# EAGLE design Board V.1B (EAGLE 5.06)
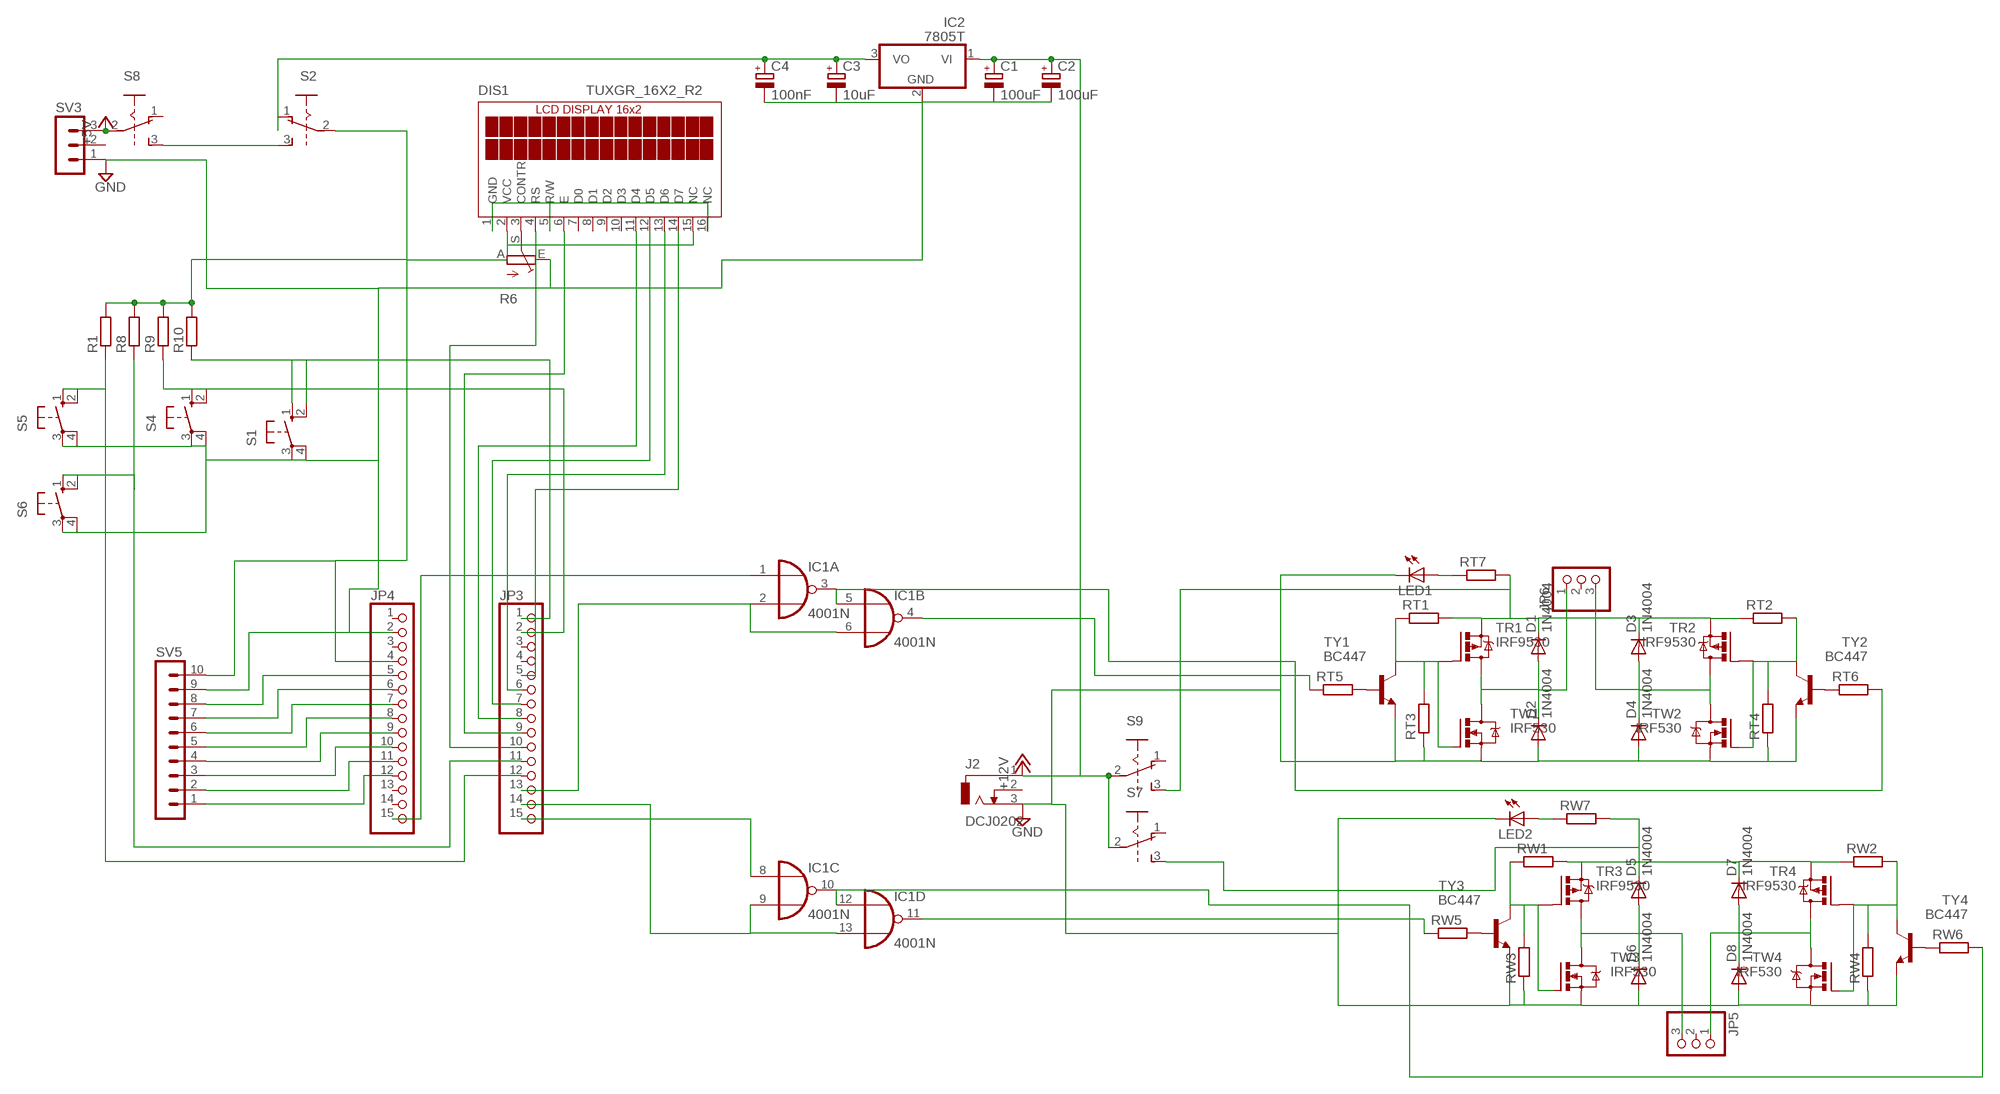
[diagram p0: schematic, sheet 1]

## Parts
C1  100uF  CPOL-EUE2.5-6  [E2,5-6]
C2  100uF  CPOL-EUE2.5-6  [E2,5-6]
C3  10uF  CPOL-EUE2.5-6  [E2,5-6]
C4  100nF  CPOL-EUE2.5-6  [E2,5-6]
D1  1N4004  [DO41-10]
D2  1N4004  [DO41-10]
D3  1N4004  [DO41-10]
D4  1N4004  [DO41-10]
D5  1N4004  [DO41-10]
D6  1N4004  [DO41-10]
D7  1N4004  [DO41-10]
D8  1N4004  [DO41-10]
DIS1  TUXGR_16X2_R2  [TUXGR_16X2_R2]
IC1  4001N  [DIL14]
IC2  7805T  [TO220H]
J2  DCJ0202  [DCJ0202]
JP3  PINHD-1X15  [1X15]
JP4  PINHD-1X15  [1X15]
JP5  PINHD-1X3  [1X03]
JP6  PINHD-1X3  [1X03]
LED1  LED5MM  [LED5MM]
LED2  LED5MM  [LED5MM]
R1  R-EU_0204/7  [0204/7]
R6  TRIM_EU-B25P  [B25P]
R8  R-EU_0204/7  [0204/7]
R9  R-EU_0204/7  [0204/7]
R10  R-EU_0204/7  [0204/7]
RT1  R-EU_0207/7  [0207/7]
RT2  R-EU_0207/7  [0207/7]
RT3  R-EU_0207/7  [0207/7]
RT4  R-EU_0207/7  [0207/7]
RT5  R-EU_0207/7  [0207/7]
RT6  R-EU_0207/7  [0207/7]
RT7  R-EU_0207/7  [0207/7]
RW1  R-EU_0207/7  [0207/7]
RW2  R-EU_0207/7  [0207/7]
RW3  R-EU_0207/7  [0207/7]
RW4  R-EU_0207/7  [0207/7]
RW5  R-EU_0207/7  [0207/7]
RW6  R-EU_0207/7  [0207/7]
RW7  R-EU_0207/7  [0207/7]
S1  10-XX  [B3F-10XX]
S2  A68-A31  [A68-A31]
S4  10-XX  [B3F-10XX]
S5  10-XX  [B3F-10XX]
S6  10-XX  [B3F-10XX]
S7  A68-A31  [A68-A31]
S8  A68-A31  [A68-A31]
S9  A68-A31  [A68-A31]
SV3  MA03-1  [MA03-1]
SV5  MA10-1  [MA10-1]
TR1  IRF9530  [TO220BV]
TR2  IRF9530  [TO220BV]
TR3  IRF9530  [TO220BV]
TR4  IRF9530  [TO220BV]
TW1  IRF530  [TO220BV]
TW2  IRF530  [TO220BV]
TW3  IRF530  [TO220BV]
TW4  IRF530  [TO220BV]
TY1  BC447  [TO92-EBC]
TY2  BC447  [TO92-EBC]
TY3  BC447  [TO92-EBC]
TY4  BC447  [TO92-EBC]

## Nets
12V-A: D1.C D3.C RT1.2 RT2.1 RT7.2 S9.3(A:S) TR1.S TR2.S
12V-B: D5.C D7.C RW1.2 RW2.1 RW7.2 S7.3(A:S) TR3.S TR4.S
+5V: S8.2(A:P) SV3.3
+5V2: DIS1.2(VCC) DIS1.15(NC) JP4.4 R1.2 R6.A R8.2 R9.2 R10.2 S2.2(A:P) SV5.10
+12V: C1.+ C2.+ IC2.1(VI) J2.1 S7.2(A:P) S9.2(A:P)
GND: C1.- C2.- C3.- C4.- D2.A D4.A D6.A D8.A IC2.2(GND) J2.3 JP4.2 LED1.K(C) LED2.K(C) R6.E RT3.1 RT4.1 RW3.1 RW4.1 S1.3(P) S1.4(P1) S4.3(P) S4.4(P1) S5.3(P) S5.4(P1) S6.3(P) S6.4(P1) SV3.1 SV5.9 TW1.S TW2.S TW3.S TW4.S TY1.E TY2.E TY3.E TY4.E
N$1: LED1.A RT7.1
N$2: LED2.A RW7.1
N$3: IC1.4(B:O) RT5.1
N$4: IC1.1(A:I0) JP4.15
N$5: S2.3(A:S) S8.3(A:S)
N$7: JP3.1 R10.1 S1.1(S) S1.2(S1)
N$8: C3.+ C4.+ IC2.3(VO)
N$9: RT1.1 RT3.2 TR1.G TW1.G TY1.C
N$11: DIS1.4(RS) JP3.10
N$12: IC1.8(C:I0) JP3.15
N$13: DIS1.3(CONTR) R6.S
N$14: DIS1.6(E) JP3.9
N$16: DIS1.11(D4) JP3.8
N$17: RT5.2 TY1.B
N$18: RT6.1 TY2.B
N$19: RT2.2 RT4.2 TR2.G TW2.G TY2.C
N$20: D7.A D8.C JP5.1 TR4.D TW4.D
N$21: D5.A D6.C JP5.3 TR3.D TW3.D
N$22: RW2.2 RW4.2 TR4.G TW4.G TY4.C
N$23: JP4.5 SV5.8
N$24: JP4.6 SV5.7
N$25: JP4.7 SV5.6
N$26: JP4.8 SV5.5
N$27: JP4.9 SV5.4
N$28: DIS1.12(D5) JP3.7
N$29: DIS1.13(D6) JP3.6
N$30: DIS1.14(D7) JP3.5
N$31: RW1.1 RW3.2 TR3.G TW3.G TY3.C
N$32: JP3.2 R9.1 S4.1(S) S4.2(S1)
N$33: JP3.11 R8.1 S6.1(S) S6.2(S1)
N$34: JP3.12 R1.1 S5.1(S) S5.2(S1)
N$35: RW6.1 TY4.B
N$36: DIS1.1(GND) DIS1.5(R/W) DIS1.16(NC)
N$38: RW5.2 TY3.B
N$40: IC1.2(A:I1) IC1.6(B:I1) JP3.13
N$45: IC1.9(C:I1) IC1.13(D:I1) JP3.14
N$46: JP4.10 SV5.3
N$47: JP4.11 SV5.2
N$49: JP4.12 SV5.1
N$51: D1.A D2.C JP6.1 TR1.D TW1.D
N$52: D3.A D4.C JP6.3 TR2.D TW2.D
N$53: IC1.3(A:O) IC1.5(B:I0) RT6.2
N$54: IC1.10(C:O) IC1.12(D:I0) RW6.2
N$55: IC1.11(D:O) RW5.1
Unconnected: DIS1.7(D0) DIS1.8(D1) DIS1.9(D2) DIS1.10(D3) J2.2 JP3.3 JP3.4 JP4.1 JP4.3 JP4.13 JP4.14 JP5.2 JP6.2 S2.1(A:O) S2.4(B:O) S2.5(B:P) S2.6(B:S) S7.1(A:O) S7.4(B:O) S7.5(B:P) S7.6(B:S) S8.1(A:O) S8.4(B:O) S8.5(B:P) S8.6(B:S) S9.1(A:O) S9.4(B:O) S9.5(B:P) S9.6(B:S) SV3.2

## Power pins joined to a net without a drawn wire
+5V: IC1.14(P:VDD)
GND: IC1.7(P:VSS)

## Library data of the parts
C1-C4 = resistor:CPOL-EU: POLARIZED CAPACITOR, European symbol
D1-D8 = diode:1N4004: DIODE general purpose rectifier, 1 A
DIS1 = display-lcd:TUXGR_16X2_R2: Tuxgraphics LCD display 16x2 characters reflective, without background light Source: tuxgr_12x2_r2.pdf
IC1 = 40xx:4001: Quad 2-input NOR
IC2 = linear:78*: Positive VOLTAGE REGULATOR Source: http://cache.national.com/ds/LM/LM78L05.pdf http://www.fairchildsemi.com/ds/LM/LM7805.pdf
J2 = con-jack:DCJ0202: DC POWER JACK Source: DCJ0202.pdf
JP3 JP4 = pinhead:PINHD-1X15: PIN HEADER
JP5 JP6 = pinhead:PINHD-1X3: PIN HEADER
LED1 LED2 = led:LED: LED OSRAM: - CHIPLED LG R971, LG N971, LY N971, LG Q971, LY Q971, LO R971, LY R971 LH N974, LH R974 LS Q976, LO Q976, LY Q976 LO Q996 - Hyper CHIPLED LW Q18S LB Q993, LB Q99A, LB R99A - SideLED LS A670, LO A670, LY A670, LG A670, LP A670 LB A673, LV A673, LT A673, LW A673 LH A674 LY A675 LS A676, LA A676, LO A676, LY A676, LW A676 LS A679, LY A679, LG A679 - Hyper Micro SIDELED® LS Y876, LA Y876, LO Y876, LY Y876 LT Y87S - SmartLED LW L88C, LW L88S LB L89C, LB L89S, LG L890 LS L89K, LO L89K, LY L89K LS L896, LA L896, LO L896, LY L896 - TOPLED LS T670, LO T670, LY T670, LG T670, LP T670 LSG T670, LSP T670, LSY T670, LOP T670, LYG T670 LG T671, LOG T671, LSG T671 LB T673, LV T673, LT T673, LW T673 LH T674 LS T676, LA T676, LO T676, LY T676, LB T676, LH T676, LSB T676, LW T676 LB T67C, LV T67C, LT T67C, LS T67K, LO T67K, LY T67K, LW E67C LS E67B, LA E67B, LO E67B, LY E67B, LB E67C, LV E67C, LT E67C LW T67C LS T679, LY T679, LG T679 LS T770, LO T770, LY T770, LG T770, LP T770 LB T773, LV T773, LT T773, LW T773 LH T774 LS E675, LA E675, LY E675, LS T675 LS T776, LA T776, LO T776, LY T776, LB T776 LHGB T686 LT T68C, LB T68C - Hyper Mini TOPLED® LB M676 - Mini TOPLED Santana® LG M470 LS M47K, LO M47K, LY M47K Source: http://www.osram.convergy.de LUXEON: - LUMILED® LXK2-PW12-R00, LXK2-PW12-S00, LXK2-PW14-U00, LXK2-PW14-V00 LXK2-PM12-R00, LXK2-PM12-S00, LXK2-PM14-U00 LXK2-PE12-Q00, LXK2-PE12-R00, LXK2-PE12-S00, LXK2-PE14-T00, LXK2-PE14-U00 LXK2-PB12-K00, LXK2-PB12-L00, LXK2-PB12-M00, LXK2-PB14-N00, LXK2-PB14-P00, LXK2-PB14-Q00 LXK2-PR12-L00, LXK2-PR12-M00, LXK2-PR14-Q00, LXK2-PR14-R00 LXK2-PD12-Q00, LXK2-PD12-R00, LXK2-PD12-S00 LXK2-PH12-R00, LXK2-PH12-S00 LXK2-PL12-P00, LXK2-PL12-Q00, LXK2-PL12-R00 Source: www.luxeon.com KINGBRIGHT: KA-3528ASYC Source: www.kingbright.com
R1 R8-R10 RT1-RT7 RW1-RW7 = resistor:R-EU_: RESISTOR, European symbol
R6 = pot:TRIM_EU-: POTENTIOMETER
S1 S4-S6 = switch-omron:10-XX: OMRON SWITCH
S2 S7-S9 = switch:A68-A31: SLIDING SWITCH Siemens, distributor Buerklin, 11G766
SV3 = con-lstb:MA03-1: PIN HEADER
SV5 = con-lstb:MA10-1: PIN HEADER
TR1-TR4 = transistor-power:IRF9530: P-CHANNEL HEXFET POWER-MOS-FET Source: http://www.irf.com/product-info/datasheets/data/irf9530.pdf
TW1-TW4 = transistor-power:IRF530: HEXFET Power MOSFET
TY1-TY4 = transistor-npn:BC447*: NPN Transistor

## Net classes
0 default: width 0.051 mm, clearance 0.051 mm

## Board
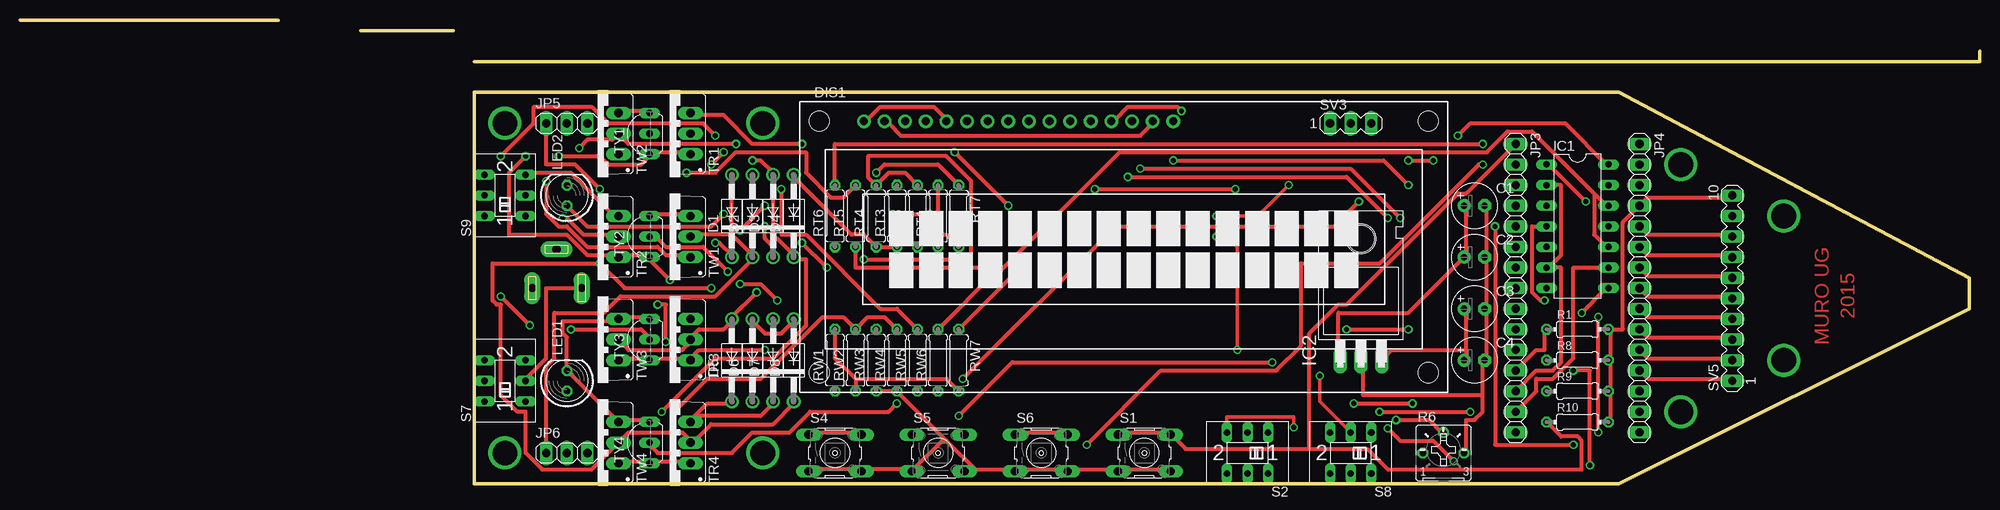
[diagram p1: board, top side]
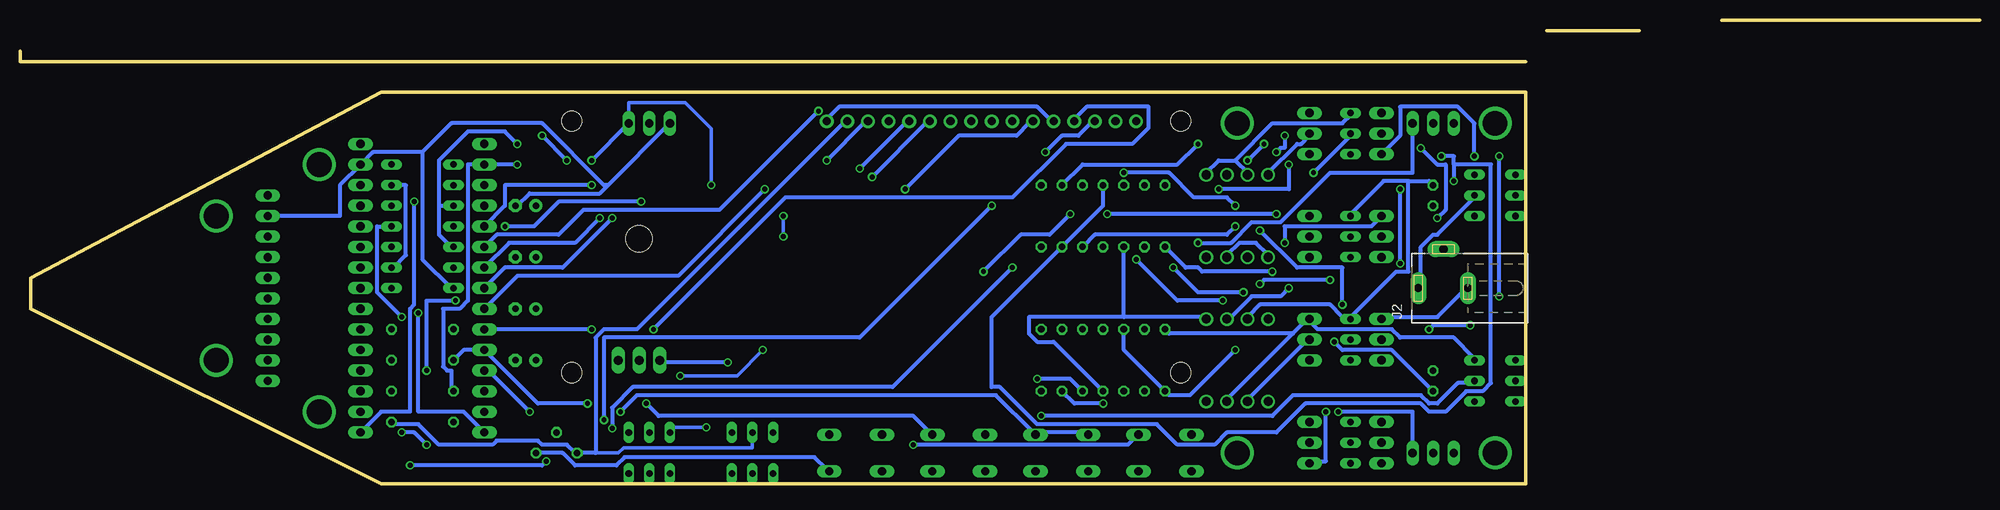
[diagram p2: board, bottom side, seen from below]

Size 241.3 x 57.15 mm. Coordinates in mm from the lower left corner, seen from the top.
Outline: 55.88,52.07 241.3,52.07 241.3,53.34
Outline: 31.75,57.15 0,57.15
Outline: 53.34,55.88 41.91,55.88
Outline: 196.85,48.26 55.88,48.26 55.88,0 196.85,0 240.03,21.59 240.03,25.4 196.85,48.26
Copper layers (1*16): Top 0.035mm / dielectric 1.5mm / Bottom 0.035mm
Design rules "default *": minimum track width 20mil, minimum drill 24mil, track to track 8mil, track to pad 8mil, pad to pad 8mil, via to via 8mil, smd to smd 8mil, copper to edge 40mil, drill to drill 8mil, minimum pad ring 10mil, minimum via ring 8mil, stop-mask expansion 4mil, vias tented up to drill 0mil, thermal gap 10mil

### Footprints (pad centres in the part's own frame; a part is rotated, then mirrored left to right if it is on the bottom)
E2,5-6 = drill 0.813 pad 1.6 round: + -1.27,0 | drill 0.813 pad 1.6 octagon: - 1.27,0
DO41-10 = drill 1.118 round: A 5.08,0; C -5.08,0
TUXGR_16X2_R2 = drill 1 pad 1.676 round: 1 -32,15.5; 2 -29.46,15.5; 3 -26.92,15.5; 4 -24.38,15.5; 5 -21.84,15.5; 6 -19.3,15.5; 7 -16.76,15.5; 8 -14.22,15.5; 9 -11.68,15.5; 10 -9.14,15.5; 11 -6.6,15.5; 12 -4.06,15.5; 13 -1.52,15.5; 14 1.02,15.5; 15 3.56,15.5; 16 6.1,15.5 | hole 2.5: -37.5,-15.5; 37.5,-15.5; -37.5,15.5; 37.5,15.5
DIL14 = drill 0.813 long: 1 -7.62,-3.81; 2 -5.08,-3.81; 3 -2.54,-3.81; 4 0,-3.81; 5 2.54,-3.81; 6 5.08,-3.81; 7 7.62,-3.81; 8 7.62,3.81; 9 5.08,3.81; 10 2.54,3.81; 11 0,3.81; 12 -2.54,3.81; 13 -5.08,3.81; 14 -7.62,3.81
TO220H = drill 1.118 long: 1 -2.54,-10.16; 2 0,-10.16; 3 2.54,-10.16 | hole 3.302: 0,4.826
DCJ0202 = drill 1 pad 2 long: 1 0,3.1; 2 4.8,0; 3 0,-3
1X15 = drill 1.016 long: 1 -17.78,0; 2 -15.24,0; 3 -12.7,0; 4 -10.16,0; 5 -7.62,0; 6 -5.08,0; 7 -2.54,0; 8 0,0; 9 2.54,0; 10 5.08,0; 11 7.62,0; 12 10.16,0; 13 12.7,0; 14 15.24,0; 15 17.78,0
1X03 = drill 1.016 long: 1 -2.54,0; 2 0,0; 3 2.54,0
LED5MM = drill 0.813 octagon: A -1.27,0; K 1.27,0
0204/7 = drill 0.813 octagon: 1 -3.81,0; 2 3.81,0
B25P = drill 0.813 octagon: A -2.54,0; E 2.54,0; S 0,2.54
0207/7 = drill 0.813 octagon: 1 -3.81,0; 2 3.81,0
B3F-10XX = drill 1.016 long: 1 -3.251,2.261; 2 3.251,2.261; 3 -3.251,-2.261; 4 3.251,-2.261
A68-A31 = drill 0.813 long: 1 -2.54,-2.54; 2 0,-2.54; 3 2.54,-2.54; 4 -2.54,2.54; 5 0,2.54; 6 2.54,2.54
MA03-1 = drill 1.016 long: 1 -2.54,0; 2 0,0; 3 2.54,0
MA10-1 = drill 1.016 long: 1 -11.43,0; 2 -8.89,0; 3 -6.35,0; 4 -3.81,0; 5 -1.27,0; 6 1.27,0; 7 3.81,0; 8 6.35,0; 9 8.89,0; 10 11.43,0
TO220BV = drill 1.016 long: D 0,-2.54; G -2.54,-2.54; S 2.54,-2.54
TO92-EBC = drill 0.813 long: B 0,-1.27; C -2.54,-1.27; E 2.54,-1.27

### Placement (x,y rotation side)
C1  179.07,34.29 0 top
C2  179.07,27.94 0 top
C3  179.07,21.59 0 top
C4  179.07,15.24 0 top
D1  87.63,33.02 90 top
D2  90.17,33.02 90 top
D3  92.71,33.02 90 top
D4  95.25,33.02 90 top
D5  87.63,15.24 90 top
D6  90.17,15.24 90 top
D7  92.71,15.24 90 top
D8  95.25,15.24 90 top
DIS1  135.89,29.21 0 top
IC1  191.77,31.75 270 top
IC2  165.1,25.4 0 top
J2  66.04,24.13 90 bottom
JP3  184.15,24.13 270 top
JP4  199.39,24.13 270 top
JP5  67.31,44.45 0 top
JP6  67.31,3.81 0 top
LED1  67.31,12.7 90 top
LED2  67.31,35.56 90 top
R1  191.77,19.05 0 top
R6  175.26,3.81 0 top
R8  191.77,15.24 0 top
R9  191.77,11.43 0 top
R10  191.77,7.62 0 top
RT1  113.03,33.02 90 top
RT2  110.49,33.02 90 top
RT3  107.95,33.02 90 top
RT4  105.41,33.02 90 top
RT5  102.87,33.02 90 top
RT6  100.33,33.02 90 top
RT7  115.57,33.02 270 top
RW1  100.33,15.24 90 top
RW2  102.87,15.24 90 top
RW3  105.41,15.24 90 top
RW4  107.95,15.24 90 top
RW5  110.49,15.24 90 top
RW6  113.03,15.24 90 top
RW7  115.57,15.24 270 top
S1  138.43,3.81 0 top
S2  151.13,3.81 180 top
S4  100.33,3.81 0 top
S5  113.03,3.81 0 top
S6  125.73,3.81 0 top
S7  59.69,12.7 90 top
S8  163.83,3.81 180 top
S9  59.69,35.56 90 top
SV3  163.83,44.45 0 top
SV5  210.82,24.13 90 top
TR1  80.01,43.18 90 top
TR2  71.12,30.48 90 top
TR3  80.01,17.78 90 top
TR4  80.01,5.08 90 top
TW1  80.01,30.48 90 top
TW2  71.12,43.18 90 top
TW3  71.12,17.78 90 top
TW4  71.12,5.08 90 top
TY1  76.2,43.18 90 top
TY2  76.2,30.48 90 top
TY3  76.2,17.78 90 top
TY4  76.2,5.08 90 top

### Tracks (layer width: path | path; a pad name or v marks a point on that pad's centre or on a via)
12V-A  (via drill 0.61)
  Top 0.508: S9.3 62.23,38.35 67.82,38.35 72.9,33.27 73.41,33.27 TR2.S | v85.6,29.72 86.11,29.72 87.63,28.19 D1.C | RT2.1 112.01,30.73 113.03,30.73 | 113.03,30.73 114.05,30.73 RT7.2 | 113.03,30.73 RT1.2 | v96.27,41.91 90.17,41.91 86.61,45.47 82.55,45.47 TR1.S | v91.69,31.75 91.69,30.23 92.71,29.21 D3.C
  Bottom 0.508: D1.C 87.63,28.19 89.15,29.72 91.19,29.72 92.71,28.19 D3.C | v85.6,29.72 85.6,31.75 74.93,31.75 TR2.S | v96.27,41.91 98.81,39.37 110.49,39.37 RT1.2 | v91.69,31.75 92.71,30.73 108.97,30.73 RT2.1
12V-B
  Top 0.508: RW1.2 100.33,15.49 102.87,12.95 | 102.87,12.95 RW2.1 | RW7.2 114.05,12.95 102.87,12.95 | 83.06,8.38 84.58,9.91 87.63,9.91 D5.C | 83.06,8.38 82.55,7.87 TR4.S | 83.06,8.38 91.19,8.38 92.71,9.91 D7.C
  Bottom 0.508: 82.55,20.07 81.53,19.05 72.39,19.05 71.37,18.03 64.77,18.03 62.23,15.49 S7.3 | 84.58,18.54 83.06,20.07 82.55,20.07 | 84.58,18.54 92.71,10.41 D7.C | 82.55,20.07 TR3.S | RW1.2 99.82,18.54 84.58,18.54
+5V  (via drill 0.6, 0.61)
  Top 0.406: S8.2 160.02,10.16 v160.02,13.34 | v149.86,16.51 149.86,29.21 148.59,30.48 v147.32,30.48 | v147.32,33.02 152.4,33.02 v156.21,36.83
  Top 0.508: v177.04,42.93 178.56,44.45 190.25,44.45 195.33,39.37 IC1.14 | v170.94,39.88 v173.99,39.88
  Bottom 0.406: v160.02,13.34 153.03,13.34 v149.86,16.51 | v147.32,30.48 v147.32,33.02 | v156.21,36.83 156.21,43.81 159.38,46.99 166.37,46.99 SV3.3
  Bottom 0.508: v173.99,39.88 v177.04,42.93 | v170.94,39.88 SV3.3
+5V2
  Top 0.508: DIS1.2 106.93,44.45 108.46,42.93 137.92,42.93 139.45,44.45 DIS1.15 | SV5.10 210.57,35.31 200.41,35.31 JP4.4 197.36,32.26 197.36,19.05 195.83,19.05 | 195.83,11.43 195.83,14.99 R8.2 195.83,15.49 195.83,19.05 | 195.83,11.43 195.83,7.87 R10.2 | 195.83,11.43 R9.2 | 195.83,19.05 R1.2
  Bottom 0.406: S2.2 151.13,4.45 167,4.45 167.64,3.81 170.43,3.81
  Bottom 0.508: R10.2 195.33,7.37 192.28,7.37 189.74,4.83 183.13,4.83 182.63,5.33 177.55,5.33 177.04,4.83 173.99,4.83 172.97,3.81 R6.A 170.43,3.81 170.43,18.03 169.42,19.05 165.35,19.05 139.95,44.45 DIS1.15
+12V  (via drill 0.61)
  Top 0.508: S7.2 62.23,12.95 64.77,15.49 64.77,24.13 J2.1 | C1.+ 178.05,34.29 178.05,28.19 C2.+ 170.94,21.08 162.31,21.08 162.31,15.49 IC2.1 | v115.57,8.38 122.17,14.99 v154.18,14.99
  Bottom 0.508: S9.2 62.23,35.31 66.8,30.73 67.31,30.73 68.83,29.21 68.83,24.13 J2.1 | v115.57,8.38 87.12,8.38 84.58,10.92 68.83,10.92 67.82,9.91 66.8,9.91 64.26,12.45 62.23,12.45 S7.2 | v154.18,14.99 162.31,14.99 IC2.1
GND
  Top 0.508: 180.59,21.59 180.59,27.69 C2.- 180.59,28.19 180.59,34.29 C1.- | 180.09,10.92 180.09,14.99 C4.- 180.59,15.49 180.59,21.59 | 180.09,10.92 180.09,8.89 179.07,7.87 178.05,7.87 178.05,3.81 R6.E | 180.09,10.92 165.35,10.92 165.35,14.99 IC2.2 | 180.59,21.59 C3.- | S1.4 141.48,1.78 135.38,1.78 S1.3 134.87,1.78 129.29,1.78 S6.4 128.78,1.78 122.68,1.78 S6.3 122.17,1.78 117.6,1.78 | S4.3 97.28,1.78 103.38,1.78 S4.4 103.89,1.78 109.47,1.78 S5.3 109.98,1.78 113.54,5.33 114.05,5.33 | RW3.1 RW4.1 114.05,5.33 | 117.6,1.78 116.59,1.78 S5.4 117.6,1.78 | 114.05,5.33 117.6,1.78 | TY1.E 77.47,45.97 73.91,45.97 TW2.S | RT3.1 RT4.1 103.89,30.73 102.36,30.73 95.25,37.85 D4.A | D6.A 90.17,20.07 91.69,18.54 93.73,18.54 95.25,20.07 D8.A | TY2.E 77.47,33.27 82.55,33.27 TW1.S | TY4.E 77.47,7.87 73.91,7.87 TW4.S LED1.K 67.31,18.03 66.8,18.54 66.8,20.07 73.41,20.07 TW3.S 73.91,20.57 77.47,20.57 TY3.E
  Bottom 0.508: 191.77,40.89 191.77,27.69 188.21,24.13 IC1.7 | 191.77,40.89 197.87,40.89 JP4.2 201.93,36.83 201.93,33.02 SV5.9 | 168.91,36.83 169.93,35.81 178.56,35.81 180.09,34.29 C1.- | 168.91,36.83 SV3.1 | 191.77,40.89 188.21,44.45 177.04,44.45 169.42,36.83 168.91,36.83 | 91.69,39.88 90.17,38.35 D2.A | 91.69,39.88 93.73,39.88 95.25,38.35 D4.A | 91.69,39.88 87.12,44.45 78.49,44.45 77.47,45.47 TY1.E | 105.41,20.57 RT4.1 | 105.41,20.57 95.25,20.57 D8.A | LED2.K 67.82,37.34 70.36,37.34 | 70.36,37.34 73.41,37.34 77.47,33.27 TY2.E | J2.3 63.25,24.13 66.8,20.57 73.41,20.57 TW3.S | 70.36,37.34 70.36,26.16 71.88,26.16 77.47,20.57 | 77.47,20.57 78.49,20.57 80.01,22.1 88.65,22.1 90.17,20.57 D6.A | TY3.E 77.47,20.57 | RW4.1 114.05,17.53 116.08,17.53 117.09,18.54 117.09,20.57 105.41,20.57 | R6.E 174.5,3.81 172.97,2.29 167.89,2.29 166.88,3.3 143.51,3.3 141.99,1.78 S1.4
N$1  (via drill 0.61)
  Top 0.508: v79.5,17.53 79.5,22.1 v78.49,22.1 | v88.65,31.24 v91.69,34.29 | v105.41,38.35 106.43,39.37 113.03,39.37 RT7.1
  Bottom 0.508: LED1.A 72.39,16.51 78.49,16.51 v79.5,17.53 | v78.49,22.1 78.49,26.67 84.07,26.67 v88.65,31.24 | v91.69,34.29 92.71,35.31 96.77,35.31 99.82,38.35 v105.41,38.35
N$2  (via drill 0.61)
  Top 0.508: LED2.A 69.85,31.75 85.09,31.75 v86.61,33.27 | v107.44,33.27 v112.01,33.27 | v122.68,26.16 RW7.1
  Bottom 0.508: v86.61,33.27 v107.44,33.27 | v112.01,33.27 114.55,30.73 118.11,30.73 v122.68,26.16
N$3  (via drill 0.61)
  Top 0.508: RT5.1 102.87,26.67 v119.13,26.67 | v168.4,6.86 169.93,5.33 173.99,5.33 v176.53,2.79 | v193.29,2.29 193.29,13.97 v191.26,13.97 | v187.71,22.61 187.2,22.61 186.18,23.62 186.18,31.75 IC1.4
  Bottom 0.508: v119.13,26.67 133.86,11.94 165.86,11.94 168.4,9.4 v168.4,6.86 | v176.53,2.79 177.04,2.29 v193.29,2.29 | v191.26,13.97 191.26,22.61 v187.71,22.61
N$4  (via drill 0.61)
  Top 0.508: v192.79,34.8 188.21,39.37 IC1.1
  Bottom 0.508: v192.79,34.8 192.79,22.1 193.29,21.59 193.29,8.89 196.85,8.89 JP4.15
N$5  (via drill 0.6)
  Top 0.406: S2.3 148.59,8.26 156.84,8.26 v156.84,6.99
  Bottom 0.406: v156.84,6.99 161.29,6.99 S8.3
N$7
  Top 0.508: 158.75,4.32 143.51,4.32 141.99,5.84 S1.2 141.48,6.35 135.38,6.35 S1.1 | 158.75,4.32 165.86,4.32 168.4,1.78 192.28,1.78 192.28,5.33 191.77,5.84 189.74,5.84 R10.1 | JP3.1 178.05,35.81 177.04,35.81 163.32,22.1 162.31,22.1 158.75,18.54 158.75,4.32
N$8
  Top 0.508: 178.05,16.51 178.05,21.59 C3.+ | 178.05,16.51 178.05,15.49 C4.+ | 178.05,16.51 168.91,16.51 IC2.3
N$9  (via drill 0.61)
  Top 0.508: TR1.G 82.55,40.89 77.47,40.89 TY1.C 77.47,40.39 76.45,39.37 72.39,39.37 71.37,40.39 v66.29,40.39 | v64.77,37.34 64.77,33.27 66.29,31.75 67.31,31.75 69.85,29.21 78.49,29.21 79.5,28.19 82.55,28.19 TW1.G
  Bottom 0.508: RT3.2 107.95,34.29 RT1.1 121.67,20.57 121.67,11.94 120.65,11.94 116.08,7.37 101.35,7.37 98.81,4.83 94.23,4.83 92.71,6.35 86.61,6.35 83.06,9.91 68.83,9.91 67.82,8.89 65.79,8.89 63.25,11.43 61.21,11.43 60.2,12.45 60.2,39.37 64.77,39.37 | 64.77,39.37 64.77,40.39 v66.29,40.39 | 64.77,39.37 v64.77,37.34
N$11  (via drill 0.61)
  Top 0.508: v163.32,19.05 v170.94,19.05
  Bottom 0.508: v170.94,19.05 JP3.10 | v163.32,19.05 147.07,35.31 119.13,35.31 112.52,41.91 104.39,41.91 102.36,43.94 102.36,46.48 109.98,46.48 111.51,44.96 DIS1.4
N$12  (via drill 0.61)
  Top 0.508: v192.28,21.08 195.33,24.13 IC1.8
  Bottom 0.508: v192.28,21.08 192.28,8.89 186.69,8.89 JP3.15
N$13  (via drill 0.61)
  Top 0.508: v169.42,7.87 173.48,7.87 175.01,6.35 R6.S | v115.06,40.89 v121.67,34.29
  Bottom 0.508: v169.42,7.87 169.42,18.03 137.92,18.03 v121.67,34.29 | v115.06,40.89 113.03,42.93 111,42.93 109.47,44.45 DIS1.3
N$14  (via drill 0.61)
  Top 0.508: v132.33,36.32 v149.61,36.32
  Bottom 0.508: JP3.9 180.09,25.65 160.27,25.65 v149.61,36.32 | v132.33,36.32 125.73,42.93 118.62,42.93 117.09,44.45 DIS1.6
N$16  (via drill 0.61)
  Top 0.508: v168.4,32.77 163.32,37.85 v136.4,37.85
  Bottom 0.508: JP3.8 181.61,26.67 174.5,26.67 v168.4,32.77 | v136.4,37.85 129.79,44.45 DIS1.11
N$17  (via drill 0.61)
  Top 0.508: RT5.2 101.35,35.31 99.82,35.31 96.77,38.35 96.77,40.89 88.14,40.89 85.6,38.35 v82.04,38.35
  Bottom 0.508: v82.04,38.35 77.47,42.93 TY1.B
N$18  (via drill 0.61)
  Top 0.508: v87.12,26.16 84.07,29.21 79.5,29.21 78.49,30.23 77.47,30.23 TY2.B
  Bottom 0.508: RT6.1 97.79,26.67 96.27,26.67 95.76,26.16 v87.12,26.16
N$19  (via drill 0.61)
  Top 0.508: RT2.2 108.97,38.35 106.93,38.35 RT4.2 104.39,37.85 104.39,40.39 114.05,40.39 117.09,37.34 117.09,27.69 v103.89,27.69 | v62.23,40.39 60.2,38.35 60.2,30.73 67.31,30.73 69.85,28.19 73.41,28.19 TR2.G 73.91,28.19 77.47,28.19 TY2.C 77.47,27.69 v80.01,25.15 | v93.22,22.61 91.19,24.64 v88.65,24.64
  Bottom 0.508: v62.23,40.39 62.23,44.45 64.26,46.48 71.37,46.48 71.37,42.93 TW2.G | v103.89,27.69 98.81,22.61 v93.22,22.61 | v88.65,24.64 88.14,25.15 v80.01,25.15
N$20  (via drill 0.61)
  Top 0.508: 82.55,5.33 81.53,6.35 74.93,6.35 TW4.D 70.36,1.78 64.26,1.78 62.23,3.81 62.23,8.89 61.21,8.89 59.18,10.92 59.18,22.1 58.67,22.1 58.17,22.61 58.17,27.18 v71.37,27.18 74.42,24.13 v85.09,24.13 | 82.55,5.33 83.06,5.33 85.09,7.37 92.71,7.37 95.25,9.91 D8.C | 82.55,5.33 TR4.D | JP5.1 64.77,39.37 68.33,39.37 v71.37,36.32
  Bottom 0.508: v71.37,27.18 v71.37,36.32 | v85.09,24.13 86.11,23.11 89.66,23.11 92.2,20.57 92.71,20.57 D7.A
N$21  (via drill 0.61)
  Top 0.508: TW3.D 74.93,16.51 81.53,16.51 82.55,17.53 TR3.D 82.55,18.03 83.57,19.05 86.61,19.05 87.63,20.07 D5.A 87.63,20.57 v90.68,23.62 | v99.31,26.67 v96.27,29.72
  Bottom 0.508: D6.C 90.17,10.41 83.06,17.53 82.55,17.53 TR3.D | JP5.3 69.85,38.35 80.01,38.35 86.11,32.26 89.66,32.26 92.2,29.72 v96.27,29.72 | v99.31,26.67 96.27,23.62 v90.68,23.62
N$22  (via drill 0.61)
  Top 0.508: RW4.2 106.43,20.57 104.39,20.57 RW2.2 101.35,20.57 98.81,20.57 91.19,12.95 84.58,12.95 v80.52,8.89 | 77.47,2.79 73.91,2.79 TW4.G | 77.47,2.79 82.55,2.79 TR4.G | 77.47,2.79 TY4.C
  Bottom 0.508: v80.52,8.89 80.52,2.79 82.55,2.79 TR4.G
N$23
  Top 0.508: JP4.5 200.41,30.73 210.57,30.73 SV5.8
N$24
  Top 0.508: JP4.6 200.41,28.19 210.57,28.19 SV5.7
N$25
  Top 0.508: JP4.7 200.41,25.65 210.57,25.65 SV5.6
N$26
  Top 0.508: JP4.8 200.41,23.11 210.57,23.11 SV5.5
N$27
  Top 0.508: JP4.9 200.41,20.57 210.57,20.57 SV5.4
N$28  (via drill 0.61)
  Top 0.508: v169.93,32.77 163.83,38.86 v137.92,38.86
  Bottom 0.508: JP3.7 181.1,29.72 172.97,29.72 v169.93,32.77 | v137.92,38.86 132.33,44.45 DIS1.12
N$29  (via drill 0.61)
  Top 0.508: v143,45.97 142.49,46.48 136.4,46.48 134.87,44.96 DIS1.13
  Bottom 0.508: JP3.6 182.63,30.73 175.01,30.73 171.96,33.78 155.19,33.78 v143,45.97
N$30  (via drill 0.61)
  Top 0.508: v170.94,36.83 167.89,39.88 v141.99,39.88
  Bottom 0.508: JP3.5 181.61,34.29 181.61,36.83 v170.94,36.83 | v141.99,39.88 137.41,44.45 DIS1.14
N$31  (via drill 0.61)
  Top 0.508: 77.47,15.49 73.91,15.49 TW3.G | 77.47,15.49 82.55,15.49 | 77.47,15.49 TY3.C | 82.55,15.49 83.57,16.51 v91.69,16.51 | 82.55,15.49 TR3.G
  Bottom 0.508: RW3.2 105.41,16.51 RW1.1 99.82,10.92 97.28,10.92 v91.69,16.51
N$32  (via drill 0.61)
  Top 0.508: S4.1 97.28,6.35 103.38,6.35 S4.2 | v131.32,4.83 140.46,13.97 154.69,13.97 157.73,17.02 157.73,27.18 167.39,27.18 179.58,39.37 v180.09,39.37
  Bottom 0.508: R9.1 188.21,11.43 188.21,13.97 188.72,13.97 189.23,14.48 189.23,21.59 187.2,21.59 186.18,22.61 186.18,39.37 JP3.2 v180.09,39.37 | v131.32,4.83 104.9,4.83 103.89,5.84 S4.2
N$33  (via drill 0.61)
  Top 0.508: S6.1 122.68,6.35 128.78,6.35 S6.2 | v164.21,9.91 v171.45,9.91
  Bottom 0.508: R8.1 186.69,16.51 JP3.11 177.55,9.91 v171.45,9.91 | v164.21,9.91 162.69,8.38 131.32,8.38 129.29,6.35 S6.2
N$34  (via drill 0.61)
  Top 0.508: JP3.12 186.69,16.51 187.71,16.51 187.71,19.05 R1.1 | v167.39,8.89 v178.56,8.89
  Bottom 0.508: S5.1 109.98,6.35 116.08,6.35 S5.2 116.59,6.35 121.16,10.92 165.35,10.92 v167.39,8.89 | v178.56,8.89 183.64,13.97 JP3.12
N$35  (via drill 0.61)
  Top 0.508: v107.95,9.91 106.93,8.89 97.28,8.89 94.74,6.35 90.17,6.35 87.63,3.81 78.49,3.81 77.47,4.83 TY4.B
  Bottom 0.508: v107.95,9.91 111.51,9.91 RW6.1
N$36
  Top 0.508: DIS1.1 104.39,44.96 105.92,46.48 112.52,46.48 114.05,44.96 DIS1.5
  Bottom 0.508: DIS1.16 141.99,44.96 140.46,46.48 116.08,46.48 114.55,44.96 DIS1.5
N$37  (via drill 3.05)
  other vias: 91.44,44.45
N$38  (via drill 0.61)
  Top 0.508: v67.82,19.05 76.45,19.05 77.47,18.03 TY3.B | v59.18,23.11 v62.74,19.56 | v59.18,40.39 63.25,44.45 63.25,46.48 70.36,46.48 72.39,44.45 84.07,44.45 v85.6,42.93 | v86.61,40.89 v85.09,39.37 | v93.73,36.32 93.73,30.73 96.77,30.73 105.92,21.59 107.95,21.59 RW5.2
  Bottom 0.508: v67.82,19.05 67.31,19.56 v62.74,19.56 | v59.18,23.11 v59.18,40.39 | v85.6,42.93 85.6,41.4 86.11,41.4 v86.61,40.89 | v85.09,39.37 85.09,36.32 v93.73,36.32
N$39  (via drill 3.05)
  other vias: 59.69,44.45
N$40
  Top 0.508: 188.21,26.67 189.74,28.19 189.74,36.83 IC1.2 | JP3.13 186.69,13.97 188.72,13.97 189.74,14.99 189.74,26.67 188.21,26.67 | 188.21,26.67 IC1.6
N$41  (via drill 3.05)
  other vias: 59.69,3.81
N$42  (via drill 3.05)
  other vias: 91.44,3.81
N$43  (via drill 3.05)
  other vias: 204.47,39.37
N$44  (via drill 3.05)
  other vias: 204.47,8.89
N$45
  Top 0.508: JP3.14 186.69,11.43 186.69,12.95 188.72,12.95 191.26,15.49 191.26,26.67 IC1.9
  Bottom 0.508: IC1.9 195.33,26.67 193.8,28.19 193.8,36.83 IC1.13
N$46
  Top 0.508: JP4.10 200.41,18.03 210.57,18.03 SV5.3
N$47
  Top 0.508: JP4.11 200.41,15.49 210.57,15.49 SV5.2
N$48  (via drill 3.05)
  other vias: 217.17,33.02
N$49
  Top 0.508: JP4.12 200.41,12.95 210.57,12.95 SV5.1
N$50  (via drill 3.05)
  other vias: 217.17,15.24
N$51
  Top 0.508: JP6.1 64.77,14.48 65.79,15.49 65.79,21.08 71.88,21.08 73.91,23.11 85.6,23.11 90.17,27.69 D2.C 90.17,28.19 87.63,30.73 | 87.63,30.73 82.55,30.73 TW1.D | 87.63,30.73 D1.A
  Bottom 0.508: TR1.D 82.55,42.93 83.57,41.91 84.07,41.91 87.63,38.35 D1.A
N$52  (via drill 0.61)
  Top 0.508: v66.8,32.77 67.31,32.77 69.34,30.73 73.41,30.73 TR2.D | v68.83,41.4 69.85,42.42 72.9,42.42 TW2.D 74.93,41.91 v88.14,41.91 | v78.99,8.89 85.6,15.49 92.71,15.49 96.77,19.56 96.77,27.69 95.25,27.69 D4.C 95.25,28.19 93.22,30.23 92.71,30.23 D3.A 92.71,38.35 91.19,39.88 v90.17,39.88
  Bottom 0.508: v66.8,32.77 65.79,33.78 65.79,39.37 66.8,39.37 v68.83,41.4 | JP6.3 69.85,8.89 v78.99,8.89 | v90.17,39.88 v88.14,41.91
N$53  (via drill 0.61)
  Top 0.508: RT6.2 100.33,41.91 v180.09,41.91
  Bottom 0.508: v180.09,41.91 181.61,43.43 186.18,43.43 189.74,39.88 189.74,34.29 | 189.74,34.29 IC1.3 | 189.74,34.29 189.74,30.73 188.21,29.21 IC1.5
N$54
  Top 0.508: RW6.2 120.14,26.16 120.65,26.16 135.38,40.89 180.59,40.89 183.13,43.43 186.18,43.43 193.8,35.81 | 193.8,35.81 195.33,34.29 IC1.12 | 193.8,35.81 193.8,30.73 195.33,29.21 IC1.10
N$55  (via drill 0.61)
  Top 0.508: v116.08,12.95 134.87,31.75 161.8,31.75 v164.85,34.8 | v181.61,31.75 181.61,4.83 v191.26,4.83 | v194.31,6.35 v194.31,20.57
  Bottom 0.508: RW5.1 112.01,12.95 v116.08,12.95 | v164.85,34.8 175.01,34.8 178.05,31.75 v181.61,31.75 | v191.26,4.83 192.79,6.35 v194.31,6.35 | v194.31,20.57 197.36,23.62 197.36,31.75 IC1.11

### Text on the board
Top: MURO UG | 2015